# EAGLE design Flex v2 (EAGLE 9.6.1)
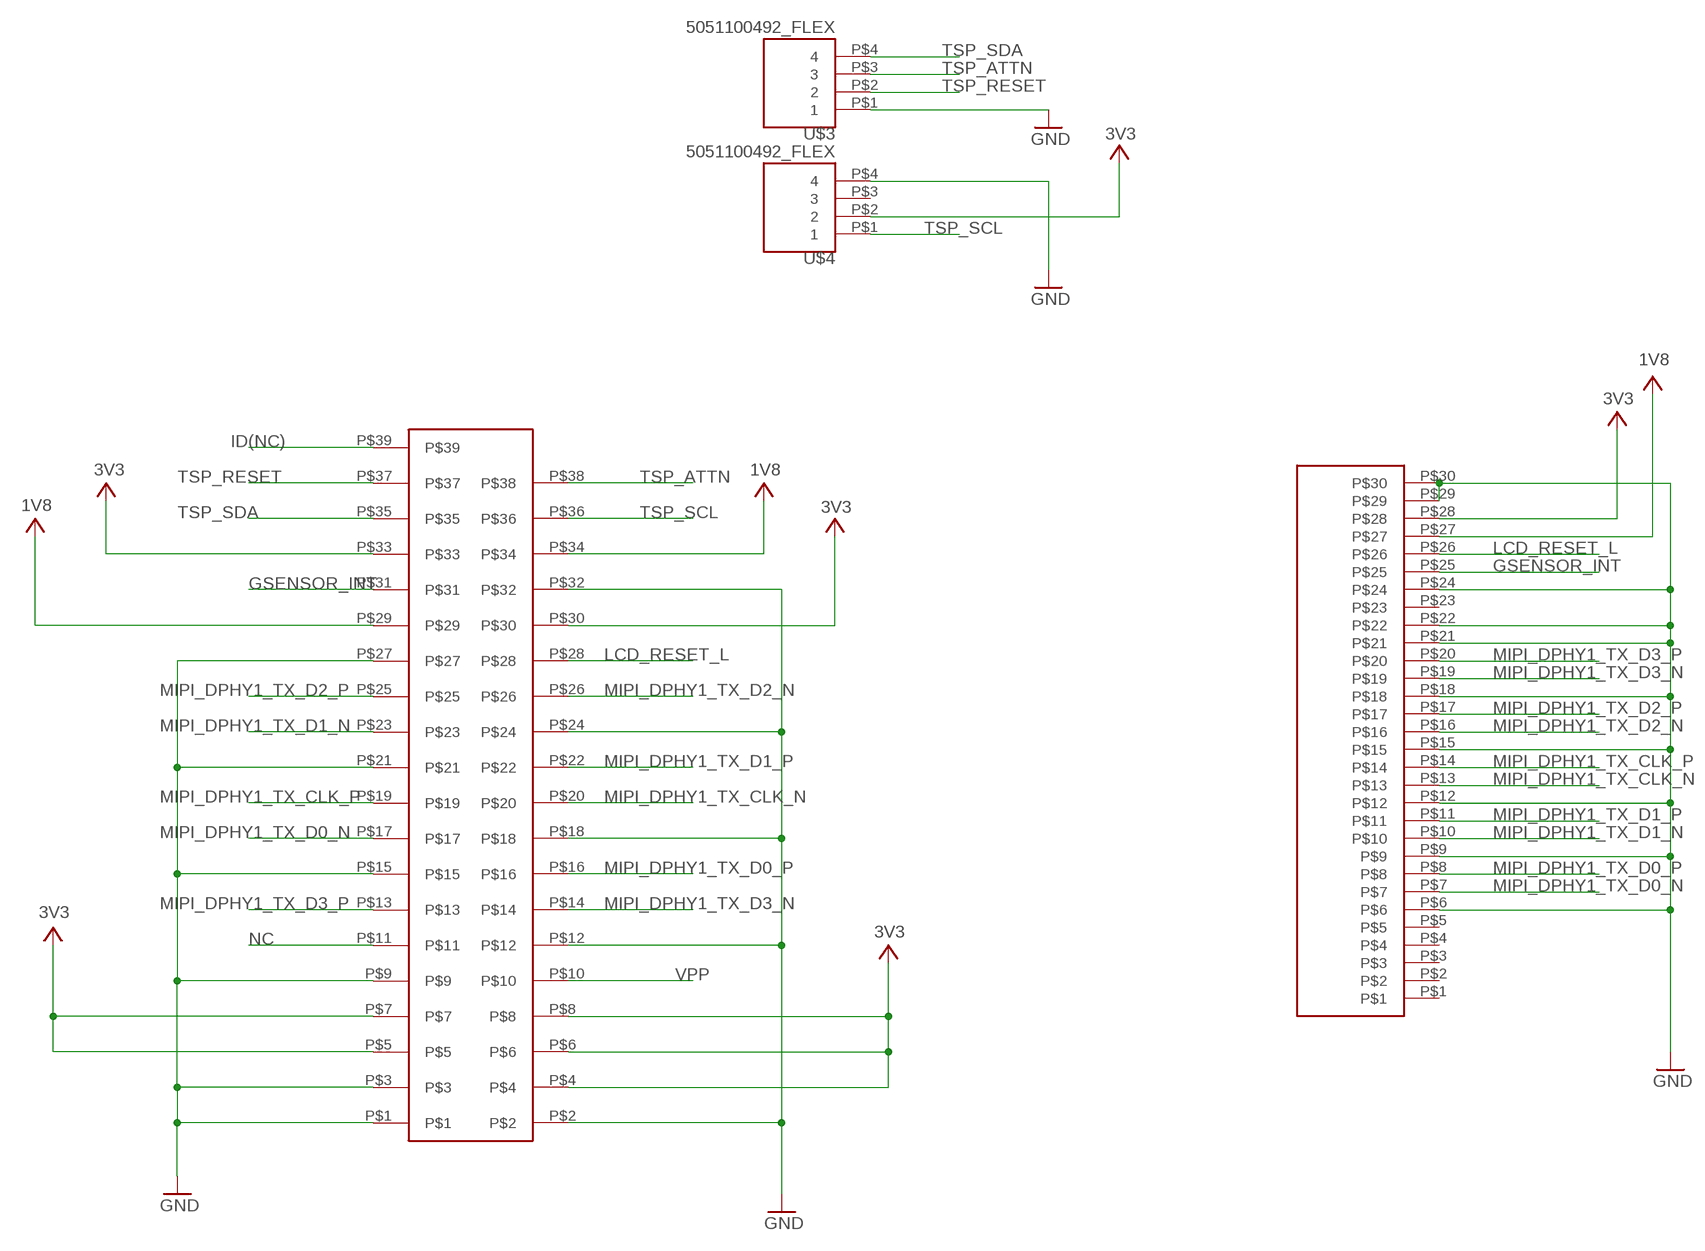
[diagram p0: schematic, sheet 1]

## Parts
U$1  FH26-39S-0.3SHW_FLEX  [FH26-39S-0.3SHW_FLEX]
U$2  5051103091  [5051103091]
U$3  5051100492_FLEX  [5051100492_FLEX]
U$4  5051100492_FLEX  [5051100492_FLEX]

## Nets
1V8: U$1.P$29 U$1.P$34 U$2.P$27 ; supply symbol labelled VCC
3V3: U$1.P$4 U$1.P$5 U$1.P$6 U$1.P$7 U$1.P$8 U$1.P$30 U$1.P$33 U$2.P$28 U$4.P$2 ; supply symbol labelled VCC
GND: U$1.P$1 U$1.P$2 U$1.P$3 U$1.P$9 U$1.P$12 U$1.P$15 U$1.P$18 U$1.P$21 U$1.P$24 U$1.P$27 U$1.P$32 U$2.P$6 U$2.P$9 U$2.P$12 U$2.P$15 U$2.P$18 U$2.P$21 U$2.P$22 U$2.P$24 U$2.P$29 U$2.P$30 U$3.P$1 U$4.P$4
GSENSOR_INT: U$1.P$31 U$2.P$25
ID(NC): U$1.P$39
LCD_RESET_L: U$1.P$28 U$2.P$26
MIPI_DPHY1_TX_CLK_N [MIPI_Flex]: U$1.P$20 U$2.P$13
MIPI_DPHY1_TX_CLK_P [MIPI_Flex]: U$1.P$19 U$2.P$14
MIPI_DPHY1_TX_D0_N [MIPI_Flex]: U$1.P$17 U$2.P$7
MIPI_DPHY1_TX_D0_P [MIPI_Flex]: U$1.P$16 U$2.P$8
MIPI_DPHY1_TX_D1_N [MIPI_Flex]: U$1.P$23 U$2.P$10
MIPI_DPHY1_TX_D1_P [MIPI_Flex]: U$1.P$22 U$2.P$11
MIPI_DPHY1_TX_D2_N [MIPI_Flex]: U$1.P$26 U$2.P$16
MIPI_DPHY1_TX_D2_P [MIPI_Flex]: U$1.P$25 U$2.P$17
MIPI_DPHY1_TX_D3_N [MIPI_Flex]: U$1.P$14 U$2.P$19
MIPI_DPHY1_TX_D3_P [MIPI_Flex]: U$1.P$13 U$2.P$20
NC: U$1.P$11
TSP_ATTN: U$1.P$38 U$3.P$3
TSP_RESET: U$1.P$37 U$3.P$2
TSP_SCL: U$1.P$36 U$4.P$1
TSP_SDA: U$1.P$35 U$3.P$4
VPP: U$1.P$10
Unconnected: U$2.P$1 U$2.P$2 U$2.P$3 U$2.P$4 U$2.P$5 U$2.P$23 U$4.P$3

## Library data of the parts
U$1 = FFC Connectors:FH26-39S-0.3SHW_FLEX
U$2 = FFC Connectors:5051103091
U$3 U$4 = FFC Connectors:5051100492_FLEX

## Net classes
1 MIPI_Flex: width 0.152 mm, clearance 0.064 mm
10 MIPI: width 0.142 mm, clearance 0.203 mm

## Board
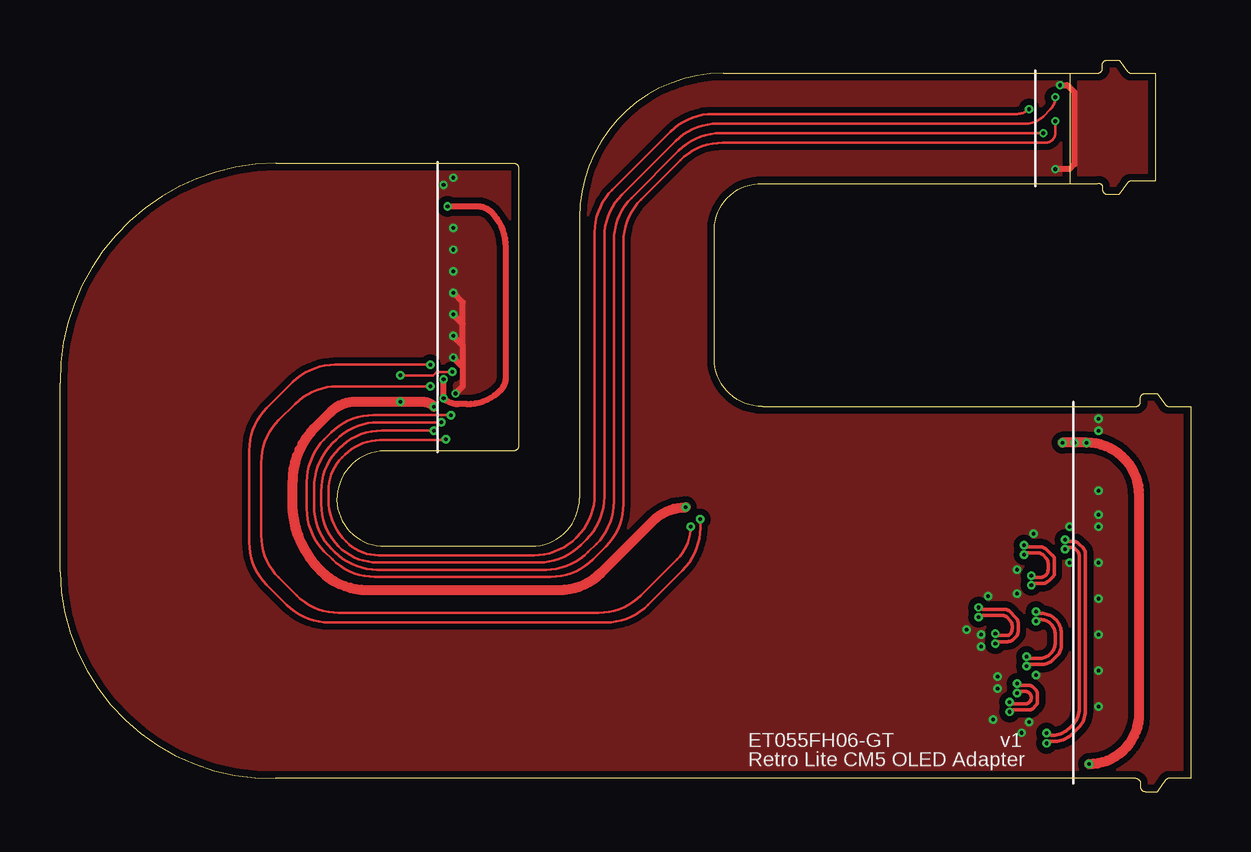
[diagram p1: board, top side]
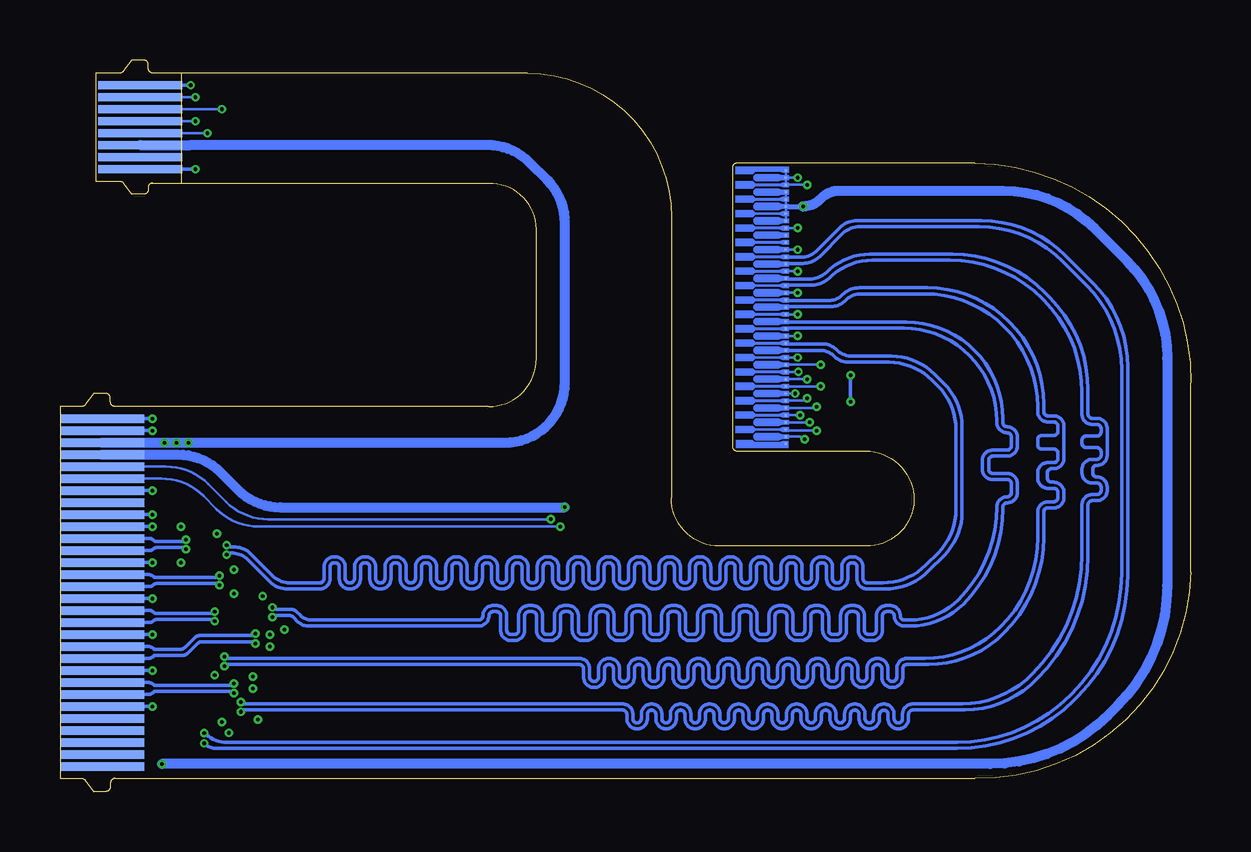
[diagram p2: board, bottom side, seen from below]

Size 47.14 x 30.5 mm. Coordinates in mm from the lower left corner, seen from the top.
Outline: 29.28,16.05 44.84,16.05 arc90 45.04,16.25 45.04,16.4 arc-90 45.24,16.6 45.74,16.6 46.08,16.13 arc54 46.24,16.05 47.14,16.05 47.14,0.55 46.24,0.55 arc54 46.08,0.47 45.74,0 45.24,0 arc-90 45.04,0.2 45.04,0.35 arc90 44.84,0.55 9,0.55 arc-90 0,9.16 0,17.04 arc-90 9,26.2 18.91,26.2 arc-90 19.11,26 19.11,14.4 arc-90 18.91,14.2 13.54,14.2 arc90 11.54,12.15 arc90 13.54,10.24 19.66,10.24 arc90 21.66,12.24 21.66,23.93 arc-90 27.66,29.95 43.25,29.95 arc90 43.45,30.15 43.45,30.3 arc-90 43.65,30.5 44.15,30.5 44.49,30.03 arc54 44.66,29.95 45.65,29.95 45.65,25.45 44.66,25.45 arc54 44.49,25.37 44.15,24.9 43.65,24.9 arc-90 43.45,25.1 43.45,25.25 arc90 43.25,25.35 29.28,25.35
Outline: 45.65,29.7 45.65,25.7
Outline: 29.28,16.05 arc-90 27.28,18.05
Outline: 27.28,23.45 arc-90 29.28,25.35
Outline: 29.28,16.05 arc-90 27.28,18.05
Outline: 27.28,18.05 27.28,23.45
Outline: 27.28,23.45 arc-90 29.28,25.35
Outline: 42.09,29.93 42.09,25.35
Copper layers (1*16): Top 0.035mm / dielectric 1.5mm / Bottom 0.035mm
Design rules "PCBWay_2L_100um-Track *": minimum track width 0.1mm, minimum drill 0.3mm, track to track 0.1mm, track to pad 0.1mm, pad to pad 0.1mm, via to via 0.1mm, smd to smd 0mil, copper to edge 0.3mm, drill to drill 10mil, minimum pad ring 6mil, minimum via ring 0.1mm, stop-mask expansion 0mil, vias tented up to drill 0.45mm, thermal gap 0.2mm
bRestrict: area 43.5,-0.1 to 47,16.7; area 16.5,14.2 to 19,26.2; area 42,25 to 45.8,30.5

### Footprints (pad centres in the part's own frame; a part is rotated, then mirrored left to right if it is on the bottom)
FH26-39S-0.3SHW_FLEX = smd 0.1 x 0.1: P$1 -0.15,0.118; P$2 -0.45,0.118; P$3 -0.75,0.118; P$4 -1.05,0.118; P$5 -1.35,0.118; P$6 -1.65,0.118; P$7 -1.95,0.118; P$8 -2.25,0.118; P$9 -2.55,0.118; P$10 -2.85,0.118; P$11 -3.15,0.118; P$12 -3.45,0.118; P$13 -3.75,0.118; P$14 -4.05,0.118; P$15 -4.35,0.118; P$16 -4.65,0.118; P$17 -4.95,0.118; P$18 -5.25,0.118; P$19 -5.55,0.118; P$20 -5.85,0.118; P$21 -6.15,0.118; P$22 -6.45,0.118; P$23 -6.75,0.118; P$24 -7.05,0.118; P$25 -7.35,0.118; P$26 -7.65,0.118; P$27 -7.95,0.118; P$28 -8.25,0.118; P$29 -8.55,0.118; P$30 -8.85,0.118; P$31 -9.15,0.118; P$32 -9.45,0.118; P$33 -9.75,0.118; P$34 -10.05,0.118; P$35 -10.35,0.118; P$36 -10.65,0.118; P$37 -10.95,0.118; P$38 -11.25,0.118; P$39 -11.55,0.118
5051103091 = smd 0.35 x 3.5: P$1 -7,0; P$2 -6.5,0; P$3 -6,0; P$4 -5.5,0; P$5 -5,0; P$6 -4.5,0; P$7 -4,0; P$8 -3.5,0; P$9 -3,0; P$10 -2.5,0; P$11 -2,0; P$12 -1.5,0; P$13 -1,0; P$14 -0.5,0; P$15 0,0; P$16 0.5,0; P$17 1,0; P$18 1.5,0; P$19 2,0; P$20 2.5,0; P$21 3,0; P$22 3.5,0; P$23 4,0; P$24 4.5,0; P$25 5,0; P$26 5.5,0; P$27 6,0; P$28 6.5,0; P$29 7,0; P$30 7.5,0
5051100492_FLEX = smd 0.35 x 3.5: P$1 0.75,0; P$2 0.25,0; P$3 -0.25,0; P$4 -0.75,0

### Placement (x,y rotation side)
U$1  16.77,26.05 90 bottom
U$2  45.39,8.05 90 bottom
U$3  43.79,28.7 90 bottom
U$4  43.79,26.7 90 bottom

### Tracks (layer width: path | path; a pad name or v marks a point on that pad's centre or on a via)
1V8  (via drill 0.15)
  Top 0.102: v16.36,17.49 15.69,17.49 15.54,17.35 v14.19,17.35
  Top 0.406: v26.09,11.85 arc45 24.72,11.28 22.57,9.13 arc-45 20.8,8.4 12.8,8.4 arc-45 10.88,9.2 arc-45 9.69,12.07 9.69,12.91 arc-45 10.61,15.15 11.28,15.82 arc-45 12.33,16.25 v14.19,16.25 15.11,16.25 arc-45 v15.59,16.05
  Bottom 0.102: U$1.P$29 v16.36,17.49 | U$1.P$34 15.64,15.99
  Bottom 0.152: 15.64,15.99 v15.59,16.05 | v14.19,17.35 v14.19,16.25
  Bottom 0.406: U$2.P$27 42.22,14.05 arc45 40.46,13.32 39.72,12.58 arc-45 37.95,11.85 v26.09,11.85
3V3  (via drill 0.15)
  Top 0.254: v16.16,24.4 17.38,24.4 arc-45 18,24.14 arc-45 18.59,22.72 18.59,17.25 arc-45 18.37,16.74 arc-45 16.96,16.15 16.58,16.15 arc-45 v15.99,16.4 v15.99,17.2
  Top 0.406: v42.89,1.15 arc90 44.99,3.25 44.99,12.35 arc90 v42.79,14.55 v42.29,14.55 v41.79,14.55
  Bottom 0.102: U$1.P$4 U$1.P$5 U$1.P$6 U$1.P$7 U$1.P$8 | U$1.P$33 16.09,16.3 v15.99,16.4 | U$1.P$30 v15.99,17.2
  Bottom 0.152: 41.71,26.93 41.69,26.95 41.71,26.95 41.71,26.93 | 41.71,26.85 41.71,26.93
  Bottom 0.203: U$1.P$6 16.19,24.4
  Bottom 0.406: 16.19,24.4 v16.16,24.4 arc-45 15.45,24.69 15.38,24.76 arc45 14.67,25.05 7.82,25.05 arc45 4.01,23.47 2.67,22.13 arc45 0.99,18.07 0.99,8.59 arc45 3.07,3.57 3.45,3.19 arc45 8.37,1.15 v42.89,1.15 | U$2.P$28 v42.79,14.55 28.59,14.55 arc-90 26.09,17.05 26.09,23.71 arc-45 26.82,25.48 27.56,26.22 arc-45 29.32,26.95 41.69,26.95 U$4.P$2
GND  (via drill 0.15)
  Top 0.254: v16.39,18.09 16.79,17.7 | 16.79,18.59 16.79,17.7 | 16.79,18.59 v16.39,18.99 | 16.79,18.59 16.79,19.49 | 16.79,19.49 v16.39,19.9 | 16.79,19.49 16.79,20.4 v16.39,20.8 | v41.69,29.45 41.99,29.45 42.29,29.15 42.29,26.15 42.09,25.95 v41.49,25.95 | 16.79,17.7 16.79,16.9 v16.49,16.59
  Bottom 0.1: U$1.P$3 v15.99,25.3
  Bottom 0.102: U$1.P$18 v16.39,20.8 | U$1.P$21 v16.39,19.9 | U$1.P$12 v16.39,22.59 | U$1.P$15 v16.39,21.7 | U$1.P$24 v16.39,18.99 | v16.39,18.09 U$1.P$27 | v16.49,16.59 U$1.P$32 | U$1.P$2 v16.39,25.59 | U$1.P$2 U$1.P$1 | U$1.P$3 U$1.P$2 | U$1.P$9 v16.39,23.49
  Bottom 0.152: U$2.P$6 v43.29,3.55 | U$2.P$9 v43.29,5.05 | U$2.P$12 v43.29,6.55 | U$2.P$15 v43.29,8.05 | U$2.P$18 v43.29,9.55 | U$2.P$21 v43.29,11.05 | U$2.P$22 v43.29,11.55 | U$2.P$24 v43.29,12.55 | U$2.P$29 v43.29,15.05 | U$2.P$30 v43.29,15.55 | U$3.P$1 v41.69,29.45 | U$4.P$4 v41.49,25.95
  other vias: 39.09,4.8 39.09,4.3 40.39,2.9 38.89,3 39.89,9.25 39.89,8.25 40.59,10.75 38.69,8.15 38.39,6.55 38.39,6.05 37.79,6.75 40.09,2.45 40.69,4.85 42.09,11.05 42.09,9.55
  pour Top (isolate 0.254): -3.36,32.75 -3.36,-4.05 50.19,-4.05 50.39,-3.85 50.39,32.75
GSENSOR_INT  (via drill 0.15)
  Top 0.102: v26.29,11.05 arc-45 25.72,9.69 24.22,8.18 arc-45 22.45,7.45 11.62,7.45 arc-45 9.86,8.18 9.12,8.92 arc-45 8.39,10.69 8.39,13.71 arc-45 9.12,15.48 9.8,16.16 arc-45 11.57,16.9 v15.43,16.9
  Bottom 0.1: U$1.P$31 v15.43,16.9
  Bottom 0.102: U$2.P$25 42.92,13.05 arc45 41.16,12.32 40.62,11.78 arc-45 38.85,11.05 v26.29,11.05
LCD_RESET_L  (via drill 0.15)
  Top 0.102: v26.69,11.35 26.69,10.99 arc-45 25.96,9.22 24.52,7.78 arc-45 22.75,7.05 11.22,7.05 arc-45 9.46,7.78 8.62,8.62 arc-45 7.89,10.39 7.89,14.21 arc-45 8.62,15.98 9.7,17.06 arc-45 11.47,17.8 v15.43,17.8
  Bottom 0.102: U$2.P$26 42.72,13.55 arc45 40.96,12.82 40.22,12.08 arc-45 38.45,11.35 v26.69,11.35 | U$1.P$28 v15.43,17.8
MIPI_DPHY1_TX_CLK_N  (via drill 0.15)
  Top 0.152: v40.69,7.1 40.76,7.17 40.85,7.17 arc-90 41.49,6.54 41.49,6.21 arc-45 41.3,5.76 41.27,5.74 arc-45 40.83,5.55 40.36,5.55 v40.29,5.62
  Bottom 0.152: U$2.P$13 43.38,7.05 arc-45 43.3,7.08 arc45 43.08,7.17 40.76,7.17 v40.69,7.1 | U$1.P$20 16.86,20.22 15,20.22 arc-45 14.42,20.46 arc45 13.72,20.75 11.09,20.75 arc45 7.77,19.37 arc45 6.39,16.05 6.39,15.84 arc-90 5.96,15.41 5.72,15.41 arc90 5.54,15.23 5.54,15.02 arc90 5.72,14.84 6.21,14.84 arc-90 6.39,14.67 6.39,14.46 arc-90 6.21,14.28 5.72,14.28 arc90 5.54,14.1 5.54,13.89 arc90 5.72,13.71 5.96,13.71 arc-90 6.39,13.29 6.39,13.07 arc-90 5.96,12.64 5.72,12.64 arc90 5.54,12.47 5.54,12.26 arc90 5.72,12.08 5.96,12.08 arc-90 6.39,11.65 6.39,10.59 arc45 7.94,6.86 arc45 11.09,5.55 11.83,5.55 arc-90 12.26,5.12 12.26,4.77 arc90 12.44,4.59 12.45,4.59 arc90 12.63,4.77 12.63,5.12 arc-90 13.06,5.55 13.08,5.55 arc-90 13.5,5.12 13.5,4.77 arc90 13.68,4.59 13.7,4.59 arc90 13.87,4.77 13.87,5.12 arc-90 14.3,5.55 14.32,5.55 arc-90 14.75,5.12 14.75,4.77 arc90 14.92,4.59 14.94,4.59 arc90 15.12,4.77 15.12,5.12 arc-90 15.54,5.55 15.56,5.55 arc-90 15.99,5.12 15.99,4.77 arc90 16.17,4.59 16.18,4.59 arc90 16.36,4.77 16.36,5.12 arc-90 16.79,5.55 16.8,5.55 arc-90 17.23,5.12 17.23,4.77 arc90 17.41,4.59 17.43,4.59 arc90 17.6,4.77 17.6,5.12 arc-90 18.03,5.55 18.05,5.55 arc-90 18.48,5.12 18.48,4.77 arc90 18.65,4.59 18.67,4.59 arc90 18.85,4.77 18.85,5.12 arc-90 19.27,5.55 19.29,5.55 arc-90 19.72,5.12 19.72,4.77 arc90 19.9,4.59 19.91,4.59 arc90 20.09,4.77 20.09,5.12 arc-90 20.52,5.55 20.53,5.55 arc-90 20.96,5.12 20.96,4.77 arc90 21.14,4.59 21.15,4.59 arc90 21.33,4.77 21.33,5.12 arc-90 21.76,5.55 21.78,5.55 arc-90 22.2,5.12 22.2,4.77 arc90 22.38,4.59 22.4,4.59 arc90 22.57,4.77 22.57,5.12 arc-90 23,5.55 23.02,5.55 arc-90 23.45,5.12 23.45,4.77 arc90 23.62,4.59 23.64,4.59 arc90 23.82,4.77 23.82,5.12 arc-90 24.25,5.55 24.26,5.55 arc-90 24.69,5.12 24.69,4.77 arc90 24.87,4.59 24.88,4.59 arc90 25.06,4.77 25.06,5.12 arc-90 25.49,5.55 40.21,5.55 v40.29,5.62
MIPI_DPHY1_TX_CLK_P  (via drill 0.15)
  Top 0.152: v40.69,7.5 40.76,7.43 40.91,7.43 arc-90 41.74,6.59 41.74,6.11 arc-45 41.55,5.66 41.38,5.48 arc-45 40.93,5.3 40.36,5.3 v40.29,5.22
  Bottom 0.152: U$2.P$14 43.38,7.55 arc45 43.3,7.52 arc-45 43.08,7.43 40.76,7.43 v40.69,7.5 | U$1.P$19 16.86,20.47 15.1,20.47 arc-45 14.53,20.71 arc45 13.82,21 10.99,21 arc45 7.56,19.58 arc45 6.14,16.15 6.14,15.84 arc-90 5.96,15.66 5.72,15.66 arc90 5.29,15.23 5.29,13.89 arc90 5.72,13.46 5.8,13.46 arc-90 5.98,13.29 5.98,13.07 arc-90 5.8,12.9 5.72,12.9 arc90 5.29,12.47 5.29,12.26 arc90 5.72,11.83 5.96,11.83 arc-90 6.14,11.65 6.14,10.59 arc45 7.79,6.61 arc45 10.94,5.3 11.83,5.3 arc-90 12.01,5.12 12.01,4.77 arc90 12.44,4.34 12.45,4.34 arc90 12.88,4.77 12.88,5.12 arc-90 13.06,5.3 13.08,5.3 arc-90 13.25,5.12 13.25,4.77 arc90 13.68,4.34 13.7,4.34 arc90 14.13,4.77 14.13,5.12 arc-90 14.3,5.3 14.32,5.3 arc-90 14.49,5.12 14.49,4.77 arc90 14.92,4.34 14.94,4.34 arc90 15.37,4.77 15.37,5.12 arc-90 15.54,5.3 15.56,5.3 arc-90 15.74,5.12 15.74,4.77 arc90 16.17,4.34 16.18,4.34 arc90 16.61,4.77 16.61,5.12 arc-90 16.79,5.3 16.8,5.3 arc-90 16.98,5.12 16.98,4.77 arc90 17.41,4.34 17.43,4.34 arc90 17.85,4.77 17.85,5.12 arc-90 18.03,5.3 18.05,5.3 arc-90 18.22,5.12 18.22,4.77 arc90 18.65,4.34 18.67,4.34 arc90 19.1,4.77 19.1,5.12 arc-90 19.27,5.3 19.29,5.3 arc-90 19.47,5.12 19.47,4.77 arc90 19.9,4.34 19.91,4.34 arc90 20.34,4.77 20.34,5.12 arc-90 20.52,5.3 20.53,5.3 arc-90 20.71,5.12 20.71,4.77 arc90 21.14,4.34 21.15,4.34 arc90 21.58,4.77 21.58,5.12 arc-90 21.76,5.3 21.78,5.3 arc-90 21.95,5.12 21.95,4.77 arc90 22.38,4.34 22.4,4.34 arc90 22.83,4.77 22.83,5.12 arc-90 23,5.3 23.02,5.3 arc-90 23.2,5.12 23.2,4.77 arc90 23.62,4.34 23.64,4.34 arc90 24.07,4.77 24.07,5.12 arc-90 24.25,5.3 24.26,5.3 arc-90 24.44,5.12 24.44,4.77 arc90 24.87,4.34 24.88,4.34 arc90 25.31,4.77 25.31,5.12 arc-90 25.49,5.3 40.21,5.3 v40.29,5.22
MIPI_DPHY1_TX_D0_N  (via drill 0.15)
  Top 0.152: v39.89,4.1 39.96,4.17 40.23,4.17 arc-90 40.49,3.92 40.49,3.9 arc-90 40.23,3.65 39.77,3.65 arc-45 v39.59,3.73
  Bottom 0.152: U$2.P$7 43.47,4.05 arc-45 43.24,4.14 arc45 43.17,4.17 39.96,4.17 v39.89,4.1 | U$1.P$17 16.86,21.12 15.77,21.12 arc-45 15.08,21.41 arc45 13.28,22.15 10.04,22.15 arc45 6.2,20.56 6.13,20.49 arc45 4.54,16.65 4.54,15.73 arc-90 4.11,15.31 3.92,15.31 arc90 3.74,15.13 3.74,15 arc90 3.92,14.82 4.36,14.82 arc-90 4.54,14.65 4.54,14.51 arc-90 4.36,14.34 3.92,14.34 arc90 3.74,14.16 3.74,14.03 arc90 3.92,13.85 4.11,13.85 arc-90 4.54,13.42 4.54,13.29 arc-90 4.11,12.86 3.92,12.86 arc90 3.74,12.69 3.74,12.55 arc90 3.92,12.38 4.11,12.38 arc-90 4.54,11.95 4.54,9.89 arc45 6.6,4.91 arc45 9.52,3.65 11.59,3.65 arc-90 12.02,3.22 12.02,3.04 arc90 12.19,2.86 | v39.59,3.73 39.51,3.65 23.69,3.65 arc90 23.26,3.22 23.26,3.04 arc-90 23.08,2.86 | 12.19,2.86 | 12.19,2.86 arc90 12.37,3.04 12.37,3.22 arc-90 12.8,3.65 | 12.8,3.65 | 12.8,3.65 arc-90 13.23,3.22 13.23,3.04 arc90 13.4,2.86 | 13.4,2.86 | 13.4,2.86 arc90 13.58,3.04 13.58,3.22 arc-90 14.01,3.65 | 14.01,3.65 | 14.01,3.65 arc-90 14.44,3.22 14.44,3.04 arc90 14.61,2.86 | 14.61,2.86 | 14.61,2.86 arc90 14.79,3.04 14.79,3.22 arc-90 15.22,3.65 | 15.22,3.65 | 15.22,3.65 arc-90 15.65,3.22 15.65,3.04 arc90 15.82,2.86 | 15.82,2.86 | 15.82,2.86 arc90 16,3.04 16,3.22 arc-90 16.43,3.65 | 16.43,3.65 | 16.43,3.65 arc-90 16.86,3.22 16.86,3.04 arc90 17.03,2.86 | 17.03,2.86 | 17.03,2.86 arc90 17.21,3.04 17.21,3.22 arc-90 17.64,3.65 | 17.64,3.65 | 17.64,3.65 arc-90 18.07,3.22 18.07,3.04 arc90 18.24,2.86 | 18.24,2.86 | 18.24,2.86 arc90 18.42,3.04 18.42,3.22 arc-90 18.85,3.65 | 18.85,3.65 | 18.85,3.65 arc-90 19.28,3.22 19.28,3.04 arc90 19.45,2.86 | 19.45,2.86
  Bottom 0.152: 19.45,2.86 arc90 19.63,3.04 19.63,3.22 arc-90 20.06,3.65 | 20.06,3.65 | 20.06,3.65 arc-90 20.49,3.22 20.49,3.04 arc90 20.66,2.86 | 20.66,2.86 | 20.66,2.86 arc90 20.84,3.04 20.84,3.22 arc-90 21.27,3.65 | 21.27,3.65 | 21.27,3.65 arc-90 21.7,3.22 21.7,3.04 arc90 21.87,2.86 | 21.87,2.86 | 21.87,2.86 arc90 22.05,3.04 22.05,3.22 arc-90 22.48,3.65 | 22.48,3.65 | 22.48,3.65 arc-90 22.91,3.22 22.91,3.04 arc90 23.08,2.86 | 23.08,2.86
MIPI_DPHY1_TX_D0_P  (via drill 0.15)
  Top 0.152: v39.89,4.5 39.96,4.43 40.39,4.43 arc-45 40.57,4.35 40.67,4.25 arc-45 40.74,4.07 40.74,3.75 arc-45 40.67,3.57 40.57,3.47 arc-45 40.39,3.4 39.77,3.4 arc45 v39.59,3.32
  Bottom 0.152: U$2.P$8 43.47,4.55 arc45 43.24,4.46 arc-45 43.17,4.43 39.96,4.43 v39.89,4.5 | U$1.P$16 16.86,21.37 15.87,21.37 arc-45 15.18,21.66 arc45 13.38,22.4 9.94,22.4 arc45 6.09,20.81 5.88,20.6 arc45 4.29,16.75 4.29,15.73 arc-90 4.11,15.56 3.92,15.56 arc90 3.49,15.13 3.49,14.03 arc90 3.92,13.6 arc-90 4.09,13.42 4.09,13.29 arc-90 3.92,13.12 arc90 3.49,12.69 3.49,12.55 arc90 3.92,12.13 4.11,12.13 arc-90 4.29,11.95 4.29,9.83 arc45 6.41,4.69 arc45 9.42,3.4 11.59,3.4 arc-90 11.76,3.22 11.76,3.04 arc90 12.19,2.61 | v39.59,3.32 39.51,3.4 23.69,3.4 arc90 23.51,3.22 23.51,3.04 arc-90 23.08,2.61 | 12.19,2.61 | 12.19,2.61 arc90 12.62,3.04 12.62,3.22 arc-90 12.8,3.39 | 12.8,3.39 | 12.8,3.39 arc-90 12.97,3.22 12.97,3.04 arc90 13.4,2.61 | 13.4,2.61 | 13.4,2.61 arc90 13.83,3.04 13.83,3.22 arc-90 14.01,3.4 | 14.01,3.4 | 14.01,3.4 arc-90 14.18,3.22 14.18,3.04 arc90 14.61,2.61 | 14.61,2.61 | 14.61,2.61 arc90 15.04,3.04 15.04,3.22 arc-90 15.22,3.4 | 15.22,3.4 | 15.22,3.4 arc-90 15.39,3.22 15.39,3.04 arc90 15.82,2.61 | 15.82,2.61 | 15.82,2.61 arc90 16.25,3.04 16.25,3.22 arc-90 16.43,3.4 | 16.43,3.4 | 16.43,3.4 arc-90 16.6,3.22 16.6,3.04 arc90 17.03,2.61 | 17.03,2.61 | 17.03,2.61 arc90 17.46,3.04 17.46,3.22 arc-90 17.64,3.4 | 17.64,3.4 | 17.64,3.4 arc-90 17.81,3.22 17.81,3.04 arc90 18.24,2.61 | 18.24,2.61 | 18.24,2.61 arc90 18.67,3.04 18.67,3.22 arc-90 18.85,3.4 | 18.85,3.4 | 18.85,3.4 arc-90 19.02,3.22 19.02,3.04 arc90 19.45,2.61 | 19.45,2.61 | 19.45,2.61 arc90 19.88,3.04 19.88,3.22 arc-90 20.06,3.4 | 20.06,3.4 | 20.06,3.4 arc-90 20.23,3.22 20.23,3.04 arc90 20.66,2.61 | 20.66,2.61 | 20.66,2.61 arc90 21.09,3.04 21.09,3.22 arc-90 21.27,3.4
  Bottom 0.152: 21.27,3.4 | 21.27,3.4 arc-90 21.44,3.22 21.44,3.04 arc90 21.87,2.61 | 21.87,2.61 | 21.87,2.61 arc90 22.3,3.04 22.3,3.22 arc-90 22.48,3.4 | 22.48,3.4 | 22.48,3.4 arc-90 22.65,3.22 22.65,3.04 arc90 23.08,2.61 | 23.08,2.61
MIPI_DPHY1_TX_D1_N  (via drill 0.15)
  Top 0.152: v38.99,6.18 arc-45 39.17,6.25 39.51,6.25 arc45 39.74,6.34 39.85,6.45 arc45 39.94,6.68 39.94,7.02 arc45 39.85,7.25 39.59,7.51 arc45 39.36,7.6 38.47,7.6 arc-45 v38.29,7.68
  Bottom 0.152: U$2.P$10 43.47,5.55 arc-45 43.24,5.64 arc45 43.17,5.67 42.04,5.67 arc-45 41.81,5.77 41.42,6.16 arc45 41.2,6.25 39.17,6.25 arc45 v38.99,6.18 | v38.29,7.68 arc-45 38.11,7.6 37.52,7.6 arc45 37.29,7.51 37.12,7.34 arc-45 36.67,7.15 29.69,7.15 arc-90 29.51,7.33 arc90 29.08,7.75 28.94,7.75 arc90 28.51,7.33 28.51,6.72 arc-90 28.34,6.55 28.2,6.55 arc-90 28.02,6.72 28.02,7.33 arc90 27.59,7.75 27.45,7.75 arc90 27.02,7.33 27.02,6.72 arc-90 26.85,6.55 26.71,6.55 arc-90 26.53,6.72 26.53,7.33 arc90 26.1,7.75 25.96,7.75 arc90 25.53,7.33 25.53,6.72 arc-90 25.36,6.55 25.22,6.55 arc-90 25.04,6.72 25.04,7.33 arc90 24.61,7.75 24.47,7.75 arc90 24.04,7.33 24.04,6.72 arc-90 23.87,6.55 23.72,6.55 arc-90 23.55,6.72 23.55,7.33 arc90 23.12,7.75 22.98,7.75 arc90 22.55,7.33 22.55,6.72 arc-90 22.37,6.55 22.23,6.55 arc-90 22.06,6.72 22.06,7.33 arc90 21.63,7.75 21.49,7.75 arc90 21.06,7.33 21.06,6.72 arc-90 20.88,6.55 20.74,6.55 arc-90 20.57,6.72 20.57,7.33 arc90 20.14,7.75 20,7.75 arc90 19.57,7.33 19.57,6.72 arc-90 19.39,6.55 19.25,6.55 arc-90 19.08,6.72 19.08,7.33 arc90 18.65,7.75 18.51,7.75 arc90 18.08,7.33 18.08,6.72 arc-90 17.9,6.55 17.76,6.55 arc-90 17.58,6.72 17.58,7.33 arc90 17.16,7.75 17.01,7.75 arc90 16.59,7.33 16.59,6.72 arc-90 16.41,6.55 16.27,6.55 arc-90 16.09,6.72 16.09,7.33 arc90 15.66,7.75 15.52,7.75 arc90 15.1,7.33 15.1,6.72 arc-90 14.92,6.55 14.78,6.55 arc-90 14.6,6.72 14.6,7.33 arc90 14.17,7.75 14.03,7.75 arc90 13.6,7.33 13.6,6.72 arc-90 13.43,6.55 13.29,6.55 arc-90 13.11,6.72 13.11,7.33 arc90 12.68,7.75 12.54,7.75 arc90 12.11,7.33 arc-90 11.94,7.15 11.71,7.15 arc-45 9.69,7.99 arc-45 8.09,11.86 arc90 7.66,12.29 arc-90 7.48,12.46 7.48,12.83 arc-90 7.66,13.01 8.26,13.01 arc90 8.69,13.44 8.69,13.81 arc90 8.26,14.24 7.66,14.24 arc-90 7.48,14.41 7.48,14.78 arc-90 7.66,14.96 arc90 8.09,15.39 8.09,15.44 arc-45 9.22,18.18 arc-45 11.97,19.32 16.86,19.32 U$1.P$23
MIPI_DPHY1_TX_D1_P  (via drill 0.15)
  Top 0.152: v38.99,6.58 arc45 39.17,6.5 39.46,6.5 arc45 39.6,6.56 arc45 39.69,6.78 39.69,6.92 arc45 39.6,7.14 39.48,7.26 arc45 39.26,7.35 38.47,7.35 arc45 v38.29,7.27
  Bottom 0.152: U$2.P$11 43.47,6.05 arc45 43.24,5.96 arc-45 43.17,5.93 42.14,5.93 arc-45 41.92,6.02 41.53,6.41 arc45 41.3,6.5 39.17,6.5 arc-45 v38.99,6.58 | U$1.P$22 16.86,19.57 11.86,19.57 arc45 9.02,18.39 arc45 7.84,15.55 7.84,15.39 arc-90 7.66,15.21 arc90 7.23,14.78 7.23,14.41 arc90 7.66,13.98 8.25,13.98 arc-90 8.43,13.81 8.43,13.44 arc-90 8.25,13.26 7.66,13.26 arc90 7.23,12.83 7.23,12.46 arc90 7.66,12.03 arc-90 7.84,11.86 7.84,11.8 arc45 9.49,7.81 arc45 11.69,6.9 11.94,6.9 arc90 12.37,7.33 arc-90 12.54,7.5 12.68,7.5 arc-90 12.86,7.33 12.86,6.72 arc90 13.29,6.29 13.43,6.29 arc90 13.86,6.72 13.86,7.33 arc-90 14.03,7.5 14.17,7.5 arc-90 14.35,7.33 14.35,6.72 arc90 14.78,6.29 14.92,6.29 arc90 15.35,6.72 15.35,7.33 arc-90 15.52,7.5 15.66,7.5 arc-90 15.84,7.33 15.84,6.72 arc90 16.27,6.29 16.41,6.29 arc90 16.84,6.72 16.84,7.33 arc-90 17.01,7.5 17.16,7.5 arc-90 17.33,7.33 17.33,6.72 arc90 17.76,6.29 17.9,6.29 arc90 18.33,6.72 18.33,7.33 arc-90 18.51,7.5 18.65,7.5 arc-90 18.82,7.33 18.82,6.72 arc90 19.25,6.29 19.39,6.29 arc90 19.82,6.72 19.82,7.33 arc-90 20,7.5 20.14,7.5 arc-90 20.31,7.33 20.31,6.72 arc90 20.74,6.29 20.88,6.29 arc90 21.31,6.72 21.31,7.33 arc-90 21.49,7.5 21.63,7.5 arc-90 21.8,7.33 21.8,6.72 arc90 22.23,6.29 22.37,6.29 arc90 22.8,6.72 22.8,7.33 arc-90 22.98,7.5 23.12,7.5 arc-90 23.3,7.33 23.3,6.72 arc90 23.72,6.29 23.87,6.29 arc90 24.29,6.72 24.29,7.33 arc-90 24.47,7.5 24.61,7.5 arc-90 24.79,7.33 24.79,6.72 arc90 25.22,6.29 25.36,6.29 arc90 25.78,6.72 25.78,7.33 arc-90 25.96,7.5 26.1,7.5 arc-90 26.28,7.33 26.28,6.72 arc90 26.71,6.29 26.85,6.29 arc90 27.28,6.72 27.28,7.33 arc-90 27.45,7.5 27.59,7.5 arc-90 27.77,7.33 27.77,6.72 arc90 28.2,6.29 28.34,6.29 arc90 28.77,6.72 28.77,7.33 arc-90 28.94,7.5 29.08,7.5 arc-90 29.26,7.33 arc90 29.69,6.9 36.77,6.9 arc45 37.22,7.08 37.4,7.26 arc-45 37.62,7.35 38.11,7.35 arc-45 v38.29,7.27
MIPI_DPHY1_TX_D2_N  (via drill 0.15)
  Top 0.152: v40.49,8.6 arc-45 40.67,8.67 40.96,8.67 arc45 41.19,8.77 arc22 41.44,9.02 41.44,9.76 arc22 41.25,9.94 41.09,10.11 arc45 40.86,10.2 40.26,10.2 v40.19,10.28
  Bottom 0.152: U$2.P$16 43.38,8.55 arc-45 43.3,8.58 arc45 43.08,8.67 40.67,8.67 arc45 v40.49,8.6 | U$1.P$26 16.86,18.42 | U$1.P$26 16.87,18.41 | U$1.P$26 15.42,18.4 arc45 14.93,18.19 arc-45 14.22,17.9 12.59,17.9 arc45 10.79,17.15 10.53,16.89 arc45 9.79,15.1 9.79,11.75 arc45 10.53,9.96 11.04,9.44 arc45 12.84,8.7 13.49,8.7 arc90 13.66,8.88 13.66,9.36 arc-90 14.09,9.79 14.12,9.79 arc-90 14.55,9.36 14.55,8.88 arc90 14.73,8.7 14.76,8.7 arc90 14.93,8.88 14.93,9.36 arc-90 15.36,9.79 15.39,9.79 arc-90 15.82,9.36 15.82,8.88 arc90 16,8.7 16.03,8.7 arc90 16.2,8.88 16.2,9.36 arc-90 16.63,9.79 16.66,9.79 arc-90 17.09,9.36 17.09,8.88 arc90 17.27,8.7 17.3,8.7 arc90 17.47,8.88 17.47,9.36 arc-90 17.9,9.79 17.93,9.79 arc-90 18.36,9.36 18.36,8.88 arc90 18.54,8.7 18.57,8.7 arc90 18.74,8.88 18.74,9.36 arc-90 19.17,9.79 19.2,9.79 arc-90 19.63,9.36 19.63,8.88 arc90 19.81,8.7 19.84,8.7 arc90 20.01,8.88 20.01,9.36 arc-90 20.44,9.79 20.47,9.79 arc-90 20.9,9.36 20.9,8.88 arc90 21.08,8.7 21.11,8.7 arc90 21.28,8.88 21.28,9.36 arc-90 21.71,9.79 21.74,9.79 arc-90 22.17,9.36 22.17,8.88 arc90 22.35,8.7 22.37,8.7 arc90 22.55,8.88 22.55,9.36 arc-90 22.98,9.79 23.01,9.79 arc-90 23.44,9.36 23.44,8.88 arc90 23.61,8.7 23.64,8.7 arc90 23.82,8.88 23.82,9.36 arc-90 24.25,9.79 24.28,9.79 arc-90 24.71,9.36 24.71,8.88 arc90 24.88,8.7 24.91,8.7 arc90 25.09,8.88 25.09,9.36 arc-90 25.52,9.79 25.55,9.79 arc-90 25.98,9.36 25.98,8.88 arc90 26.15,8.7 26.18,8.7 arc90 26.36,8.88 26.36,9.36 arc-90 26.79,9.79 26.82,9.79 arc-90 27.25,9.36 27.25,8.88 arc90 27.42,8.7 27.45,8.7 arc90 27.63,8.88 27.63,9.36 arc-90 28.06,9.79 28.09,9.79 arc-90 28.52,9.36 28.52,8.88 arc90 28.69,8.7 28.72,8.7 arc90 28.9,8.88 28.9,9.36 arc-90 29.33,9.79 29.36,9.79 arc-90 29.79,9.36 29.79,8.88 arc90 29.96,8.7 29.99,8.7 arc90 30.17,8.88 30.17,9.36 arc-90 30.6,9.79 30.63,9.79 arc-90 31.06,9.36 31.06,8.88 arc90 31.23,8.7 31.26,8.7 arc90 31.44,8.88 31.44,9.36 arc-90 31.87,9.79 31.9,9.79 arc-90 32.32,9.36 32.32,8.88 arc90 32.5,8.7 32.53,8.7 arc90 32.71,8.88 32.71,9.36 arc-90 33.14,9.79 33.17,9.79 arc-90 33.59,9.36 33.59,8.88 arc90 33.77,8.7 33.8,8.7 arc90 33.98,8.88 33.98,9.36 arc-90 34.41,9.79 34.44,9.79 arc-90 34.86,9.36 34.86,8.88 arc90 35.04,8.7 35.07,8.7 arc90 35.25,8.88 35.25,9.36 arc-90 35.67,9.79 35.7,9.79 arc-90 36.13,9.36 36.13,8.88 arc90 36.31,8.7 37.57,8.7 arc45 38.27,8.99 39.19,9.91 arc-45 39.9,10.2 40.11,10.2 v40.19,10.28
MIPI_DPHY1_TX_D2_P  (via drill 0.15)
  Top 0.152: v40.49,9 arc45 40.67,8.93 40.87,8.93 arc90 41.19,9.24 41.19,9.52 arc45 41.1,9.74 40.98,9.86 arc45 40.76,9.95 40.26,9.95 v40.19,9.88
  Bottom 0.152: U$2.P$17 43.47,9.05 arc45 43.24,8.96 arc-45 43.17,8.93 40.67,8.93 arc-45 v40.49,9 | U$1.P$25 16.85,18.66 15.33,18.66 arc45 14.8,18.44 arc-45 14.1,18.15 12.48,18.15 arc45 10.69,17.41 10.28,17 arc45 9.54,15.2 9.54,11.65 arc45 10.28,9.85 10.94,9.19 arc45 12.74,8.45 13.49,8.45 arc90 13.92,8.88 13.92,9.36 arc-90 14.09,9.54 14.12,9.54 arc-90 14.3,9.36 14.3,8.88 arc90 14.73,8.45 14.76,8.45 arc90 15.19,8.88 15.19,9.36 arc-90 15.36,9.54 15.39,9.54 arc-90 15.57,9.36 15.57,8.88 arc90 16,8.45 16.03,8.45 arc90 16.46,8.88 16.46,9.36 arc-90 16.63,9.54 16.66,9.54 arc-90 16.84,9.36 16.84,8.88 arc90 17.27,8.45 17.3,8.45 arc90 17.73,8.88 17.73,9.36 arc-90 17.9,9.54 17.93,9.54 arc-90 18.11,9.36 18.11,8.88 arc90 18.54,8.45 18.57,8.45 arc90 19,8.88 19,9.36 arc-90 19.17,9.54 19.2,9.54 arc-90 19.38,9.36 19.38,8.88 arc90 19.81,8.45 19.84,8.45 arc90 20.26,8.88 20.26,9.36 arc-90 20.44,9.54 20.47,9.54 arc-90 20.65,9.36 20.65,8.88 arc90 21.08,8.45 21.11,8.45 arc90 21.53,8.88 21.53,9.36 arc-90 21.71,9.54 21.74,9.54 arc-90 21.92,9.36 21.92,8.88 arc90 22.35,8.45 22.37,8.45 arc90 22.8,8.88 22.8,9.36 arc-90 22.98,9.54 23.01,9.54 arc-90 23.19,9.36 23.19,8.88 arc90 23.61,8.45 23.64,8.45 arc90 24.07,8.88 24.07,9.36 arc-90 24.25,9.54 24.28,9.54 arc-90 24.46,9.36 24.46,8.88 arc90 24.88,8.45 24.91,8.45 arc90 25.34,8.88 25.34,9.36 arc-90 25.52,9.54 25.55,9.54 arc-90 25.72,9.36 25.72,8.88 arc90 26.15,8.45 26.18,8.45 arc90 26.61,8.88 26.61,9.36 arc-90 26.79,9.54 26.82,9.54 arc-90 26.99,9.36 26.99,8.88 arc90 27.42,8.45 27.45,8.45 arc90 27.88,8.88 27.88,9.36 arc-90 28.06,9.54 28.09,9.54 arc-90 28.26,9.36 28.26,8.88 arc90 28.69,8.45 28.72,8.45 arc90 29.15,8.88 29.15,9.36 arc-90 29.33,9.54 29.36,9.54 arc-90 29.53,9.36 29.53,8.88 arc90 29.96,8.45 29.99,8.45 arc90 30.42,8.88 30.42,9.36 arc-90 30.6,9.54 30.63,9.54 arc-90 30.8,9.36 30.8,8.88 arc90 31.23,8.45 31.26,8.45 arc90 31.69,8.88 31.69,9.36 arc-90 31.87,9.54 31.9,9.54 arc-90 32.07,9.36 32.07,8.88 arc90 32.5,8.45 32.53,8.45 arc90 32.96,8.88 32.96,9.36 arc-90 33.14,9.54 33.17,9.54 arc-90 33.34,9.36 33.34,8.88 arc90 33.77,8.45 33.8,8.45 arc90 34.23,8.88 34.23,9.36 arc-90 34.41,9.54 34.44,9.54 arc-90 34.61,9.36 34.61,8.88 arc90 35.04,8.45 35.07,8.45 arc90 35.5,8.88 35.5,9.36 arc-90 35.67,9.54 35.7,9.54 arc-90 35.88,9.36 35.88,8.88 arc90 36.31,8.45 37.67,8.45 arc45 38.38,8.74 39.3,9.66 arc-45 40,9.95 40.11,9.95 v40.19,9.88
MIPI_DPHY1_TX_D3_N  (via drill 0.15)
  Top 0.152: v41.89,10.1 arc-45 42.07,10.17 42.13,10.17 arc-45 42.36,10.08 42.4,10.04 arc-45 42.49,9.82 42.49,3.46 arc-45 42.2,2.76 42.08,2.64 arc-45 41.37,2.35 41.35,2.35 arc-45 v41.13,2.44
  Bottom 0.152: U$2.P$19 43.38,10.05 arc-45 43.3,10.08 arc45 43.08,10.17 42.07,10.17 arc45 v41.89,10.1 | U$1.P$14 16.86,22.02 16.18,22.02 arc-45 15.47,22.31 14.52,23.26 arc45 13.82,23.55 8.84,23.55 arc45 5.34,22.1 4.34,21.1 arc45 2.89,17.6 2.89,9.09 arc45 4.97,4.07 5.03,4.01 arc45 9.76,2.05 40.18,2.05 arc45 v41.13,2.44
MIPI_DPHY1_TX_D3_P  (via drill 0.15)
  Top 0.152: v41.89,10.5 arc45 42.07,10.43 42.24,10.43 arc-45 42.46,10.33 42.65,10.15 arc-45 42.74,9.92 42.74,3.36 arc-45 42.45,2.65 42.19,2.39 arc-45 41.48,2.1 41.33,2.1 arc45 v41.13,2.01
  Bottom 0.152: U$2.P$20 43.38,10.55 arc45 43.3,10.52 arc-45 43.08,10.43 42.07,10.43 arc-45 v41.89,10.5 | U$1.P$13 16.86,22.27 16.28,22.27 arc-45 15.57,22.56 14.63,23.51 arc45 13.92,23.8 8.74,23.8 arc45 5.23,22.35 4.09,21.21 arc45 2.64,17.7 2.64,8.99 arc45 4.72,3.96 4.86,3.82 arc45 9.75,1.8 40.61,1.8 arc45 v41.13,2.01
TSP_ATTN  (via drill 0.15)
  Top 0.1: v16.09,14.7 arc-45 15.98,14.65 13.35,14.65 | 11.19,12.19 11.19,12.55 | 11.92,10.42 arc45 13.29,9.85 19.75,9.85 arc45 21.52,10.58 | v40.39,28.45 arc-45 39.91,28.25 27.22,28.25 arc45 25.46,27.52 23.02,25.08 arc45 22.29,23.31 22.29,12.39
  Top 0.102: 21.52,10.58 21.56,10.62 arc45 22.29,12.39 | 11.92,10.42 arc-45 11.19,12.19 | 11.19,12.55 arc-45 11.76,13.92 11.88,14.04 arc-45 13.35,14.65
  Bottom 0.1: U$3.P$3 v40.39,28.45
  Bottom 0.102: U$1.P$38 16.33,14.8 arc45 v16.09,14.7
TSP_RESET  (via drill 0.15)
  Top 0.1: 10.89,11.99 10.89,12.51 | 11.62,10.22 arc45 13.23,9.55 19.95,9.55 arc45 21.72,10.28 | 22.69,12.29 22.69,23.11 arc-45 23.42,24.88 25.66,27.12 arc-45 27.42,27.85 40.27,27.85 arc45 40.98,28.14 41.28,28.44 arc45 v41.49,28.95
  Top 0.102: 21.72,10.28 21.96,10.52 arc45 22.69,12.29 | 11.62,10.22 arc-45 10.89,11.99 | 10.89,12.51 arc-45 11.63,14.31 arc-45 13.42,15.05 v15.59,15.05
  Bottom 0.1: U$3.P$2 v41.49,28.95
  Bottom 0.102: U$1.P$37 16.84,15.05 v15.59,15.05
TSP_SCL  (via drill 0.15)
  Top 0.1: 10.59,11.89 10.59,12.65 10.59,12.71 | 11.39,10.05 11.46,9.98 arc45 13.22,9.25 20.25,9.25 arc45 22.02,9.98 | 23.09,12.15 23.09,22.98 arc-45 23.82,24.75 25.79,26.72 arc-45 27.56,27.45 v40.99,27.45 | 13.27,15.4 v15.89,15.4
  Top 0.102: 22.02,9.98 22.36,10.32 arc45 23.09,12.09 23.09,12.15 | 11.39,10.05 11.32,10.12 arc-45 10.59,11.89 | 10.59,12.65 arc-45 11.37,14.53 11.5,14.66 arc-45 13.27,15.4
  Bottom 0.1: U$4.P$1 v40.99,27.45 | U$1.P$36 v15.89,15.4
TSP_SDA  (via drill 0.15)
  Top 0.1: v41.49,27.95 41.49,27.45 arc-90 41.09,27.05 27.62,27.05 arc45 25.86,26.32 24.22,24.68 arc45 23.49,22.91 23.49,12.05 | 10.29,11.79 10.29,12.91 | 11.02,10.02 11.36,9.68 arc45 13.12,8.95 20.45,8.95 arc45 22.22,9.68 | 13.07,15.7 v16.29,15.7
  Top 0.102: 22.22,9.68 22.76,10.22 arc45 23.49,11.99 23.49,12.05 | 11.02,10.02 arc-45 10.29,11.79 | 10.29,12.91 arc-45 11.02,14.68 11.3,14.96 arc-45 13.07,15.7
  Bottom 0.1: U$3.P$4 v41.49,27.95 | U$1.P$35 v16.29,15.7

### Text on the board
tPlace: ET055FH06-GT | v1 | Retro Lite CM5 OLED Adapter